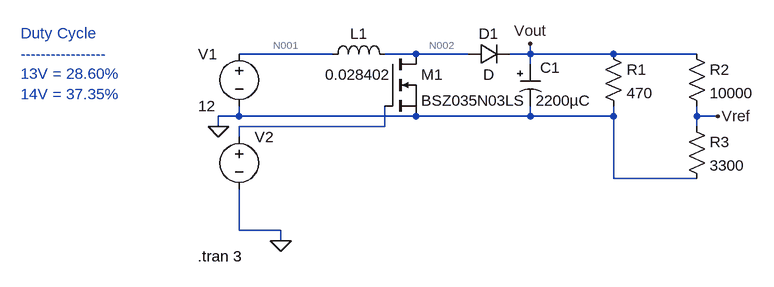
[diagram p0: schematic EEPROM Programmer.asc]
EEPROM Programmer.asc, the LTspice schematic file:
Version 4
SHEET 1 880 680
WIRE 32 -128 -112 -128
WIRE 160 -128 112 -128
WIRE 240 -128 160 -128
WIRE 336 -128 336 -144
WIRE 336 -128 304 -128
WIRE 464 -128 336 -128
WIRE 592 -128 464 -128
WIRE 336 -112 336 -128
WIRE -112 -32 -112 -48
WIRE -112 -32 -144 -32
WIRE 160 -32 -112 -32
WIRE 336 -32 336 -48
WIRE 336 -32 160 -32
WIRE 464 -32 464 -48
WIRE 464 -32 336 -32
WIRE 592 -32 592 -48
WIRE 624 -32 592 -32
WIRE -144 -16 -144 -32
WIRE 112 -16 112 -48
WIRE 112 -16 -112 -16
WIRE 592 -16 592 -32
WIRE -112 0 -112 -16
WIRE 464 64 464 -32
WIRE 592 64 464 64
WIRE -112 144 -112 80
WIRE -48 144 -112 144
WIRE -48 160 -48 144
FLAG -48 160 0
FLAG 336 -144 Vout
FLAG -144 -16 0
FLAG 624 -32 Vref
SYMBOL ind 16 -112 R270
WINDOW 0 32 56 VTop 2
WINDOW 3 0 55 VBottom 2
SYMATTR InstName L1
SYMATTR Value 0.028402
SYMATTR SpiceLine Ipk=0.03 Rser=50 Rpar=330856 Cpar=2.679p
SYMBOL nmos 112 -128 R0
SYMATTR InstName M1
SYMATTR Value BSZ035N03LS
SYMBOL voltage -112 -144 R0
WINDOW 0 -63 16 Left 2
WINDOW 3 -63 96 Left 2
WINDOW 123 0 0 Left 0
WINDOW 39 0 0 Left 0
SYMATTR InstName V1
SYMATTR Value 12
SYMBOL diode 240 -112 R270
WINDOW 0 32 32 VTop 2
WINDOW 3 0 32 VBottom 2
SYMATTR InstName D1
SYMBOL polcap 320 -112 R0
WINDOW 0 31 5 Left 2
SYMATTR InstName C1
SYMATTR Value 2200µC
SYMBOL voltage -112 -16 R0
WINDOW 3 24 96 Invisible 2
WINDOW 123 0 0 Left 0
WINDOW 39 0 0 Left 0
SYMATTR InstName V2
SYMATTR Value PULSE(0 5 0 1u 1u 0.286m 1m)
SYMBOL res 448 -144 R0
SYMATTR InstName R1
SYMATTR Value 470
SYMBOL res 576 -144 R0
SYMATTR InstName R2
SYMATTR Value 10000
SYMBOL res 576 -32 R0
SYMATTR InstName R3
SYMATTR Value 3300
TEXT -176 184 Left 2 !.tran 3
TEXT -448 -160 Left 2 ;Duty Cycle\n-----------------\n13V = 28.60%\n14V = 37.35%

The netlist it stands for:
* EEPROM Programmer.asc
L1 N001 N002 0.028402 Ipk=0.03 Rser=50 Rpar=330856 Cpar=2.679p
M1 N002 N003 0 0 BSZ035N03LS
V1 N001 0 12
D1 N002 Vout D
C1 Vout 0 2200µC
V2 N003 0 PULSE(0 5 0 1u 1u 0.286m 1m)
R1 Vout 0 470
R2 Vout Vref 10000
R3 Vref 0 3300
.model D D
.lib standard.dio
.model NMOS NMOS
.model PMOS PMOS
.lib standard.mos
.tran 3
* Duty Cycle
* -----------------
* 13V = 28.60%
* 14V = 37.35%
.backanno
.end

* Results of the author's LTspice run, read from the files saved beside the schematic
* Operating Point, zero values left out:
*   V(n001) = 12 V
*   V(n002) = 10.88 V
*   V(vout) = 10.15 V
*   V(vref) = 2.518 V
*   Id(M1) = 38.81 pA
*   Is(M1) = -38.81 pA
*   I(D1) = 22.35 mA
*   I(L1) = 22.35 mA
*   I(R3) = 762.9 µA
*   I(R2) = 762.9 µA
*   I(R1) = 21.59 mA
*   I(V1) = -22.35 mA